# Altium schematic sheet cpuotg.SchDoc: JKA 2.0 原理图
size A4; Author: JACK; CompanyName: 北京康洁之晨水处理技术有限公司; DrawnBy: 郭相炳; Organization: 北京康洁; DocumentNumber: 6; Revision: 2.0; SheetNumber: 6; SheetTotal: 6; ImagePath: E:\JKAdoc\data\LOGO.jpg; ProjectName: JKA2.0
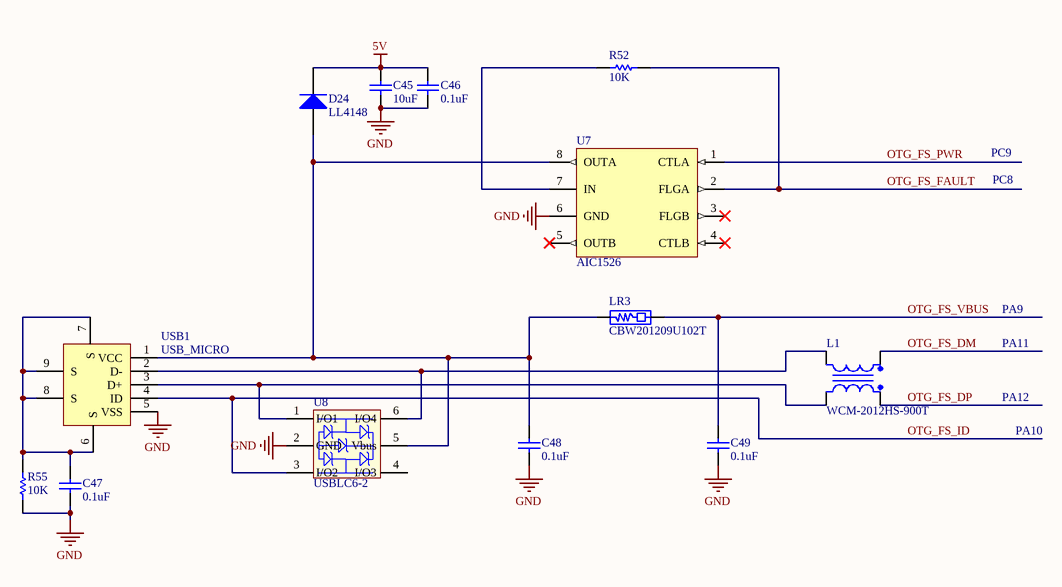
[diagram p0: cpuotg.SchDoc]

## Parts
C45  10uF  [CAPC2012M]
C46  0.1uF  [CAPC2012M]
C47  0.1uF  [CAPC2012M]
C48  0.1uF  [CAPC2012M]
C49  0.1uF  [CAPC2012M]
D24  LL4148  [CD3216-1206]
L1  WCM-2012HS-900T  [WCM-2012HS-900T]
LR3  CBW201209U102T  [INDC2012M]
R52  10K  [RESC2012M]
R55  10K  [RESC2012M]
U7  AIC1526  [SOP-8]
U8  USBLC6-2  [SOT23-6_L]
USB1  USB_MICRO  [USB-MICRO-B]

## Nets
5V: C45.1 C46.1 D24.2(K)
GND: C45.2 C46.2 C47.2 C48.2 C49.2 R55.1 U7.6(GND) U8.2(GND) USB1.5(VSS)
OTG_FS_DM: L1.2(Sec+)
OTG_FS_DP: L1.1(Pri+)
OTG_FS_FAULT: R52.2 U7.2(FLGA)
OTG_FS_ID: U8.3(I/O2) USB1.4(ID)
OTG_FS_PWR: U7.1(CTLA)
OTG_FS_VBUS: C49.1 LR3.2
NetC47_1: C47.1 R55.2 USB1.6(S) USB1.7(S) USB1.8(S) USB1.9(S)
NetC48_1: C48.1 D24.1(A) LR3.1 U7.8(OUTA) U8.5(Vbus) USB1.1(VCC)
NetL1_3: L1.3(Pri-) U8.1(I/O1) USB1.3(D+)
NetL1_4: L1.4(Sec-) U8.6(I/O4) USB1.2(D-)
NetR52_1: R52.1 U7.7(IN)

Not connected (* = marked no-connect by the designer): U7 3(FLGB)* 4(CTLB)* 5(OUTB)*; U8 4(I/O3)

## Notes on the sheet
- PC9
- PC8
- PA9
- PA11
- PA12
- PA10

## Library data of the parts
C45-C49 = Cap: Capacitor; Value: 1nF; Published: 8-Jun-2000; LatestRevisionDate: 17-Jul-2002; LatestRevisionNote: Re-released for DXP Platform.; PackageReference: RAD-0.3; Publisher: Altium Limited
D24 = Diode 1N4007: 1 Amp General Purpose Rectifier; Published: 8-Jun-2000; LatestRevisionDate: 17-Jul-2002; LatestRevisionNote: Re-released for DXP Platform.; DatasheetVersion: 1998; PackageVersion: Aug-1999; PackageReference: DO-41; Publisher: Altium Limited; Code_JEDEC: DO-204-AL; ComponentLink1Description: Manufacturer Link; ComponentLink1URL: http://www.fairchildsemi.com/; ComponentLink2Description: Datasheet; ComponentLink2URL: http://www.fairchildsemi.com/ds/1N%2F1N4001.pdf
L1 = Inductor Iron Dot Inphase: Conjugate stream coil,pitch 7.62mmx8mm(LxW); Published: 8-Jun-2000; LatestRevisionDate: 17-Jul-2002; LatestRevisionNote: Re-released for DXP Platform.; PackageReference: TRF_4; Publisher: Altium Limited
LR3 = BLM10/11/21/31/41: EMI FILTERS,DC Resistance max.0.05~1.5 ohms,10 ~ 1000 ohms at 100MHz  Frequency
R52 R55 = Res1: Resistor; Published: 8-Jun-2000; LatestRevisionDate: 17-Jul-2002; LatestRevisionNote: Re-released for DXP Platform.; PackageReference: AXIAL-0.3; Publisher: Altium Limited; Value: 10K
U7 = AIC1526: Dual USB High-Side Power Switch
U8 = USBLC6-2: USB ESD Protection Diode Array,±15kV (air), ±8kV (contact),Working Voltages 5V
USB1 = USB_MICRO: MicroUSB接口